# Altium schematic sheet main.SchDoc
size A4; SheetNumber: 1; SheetTotal: 3
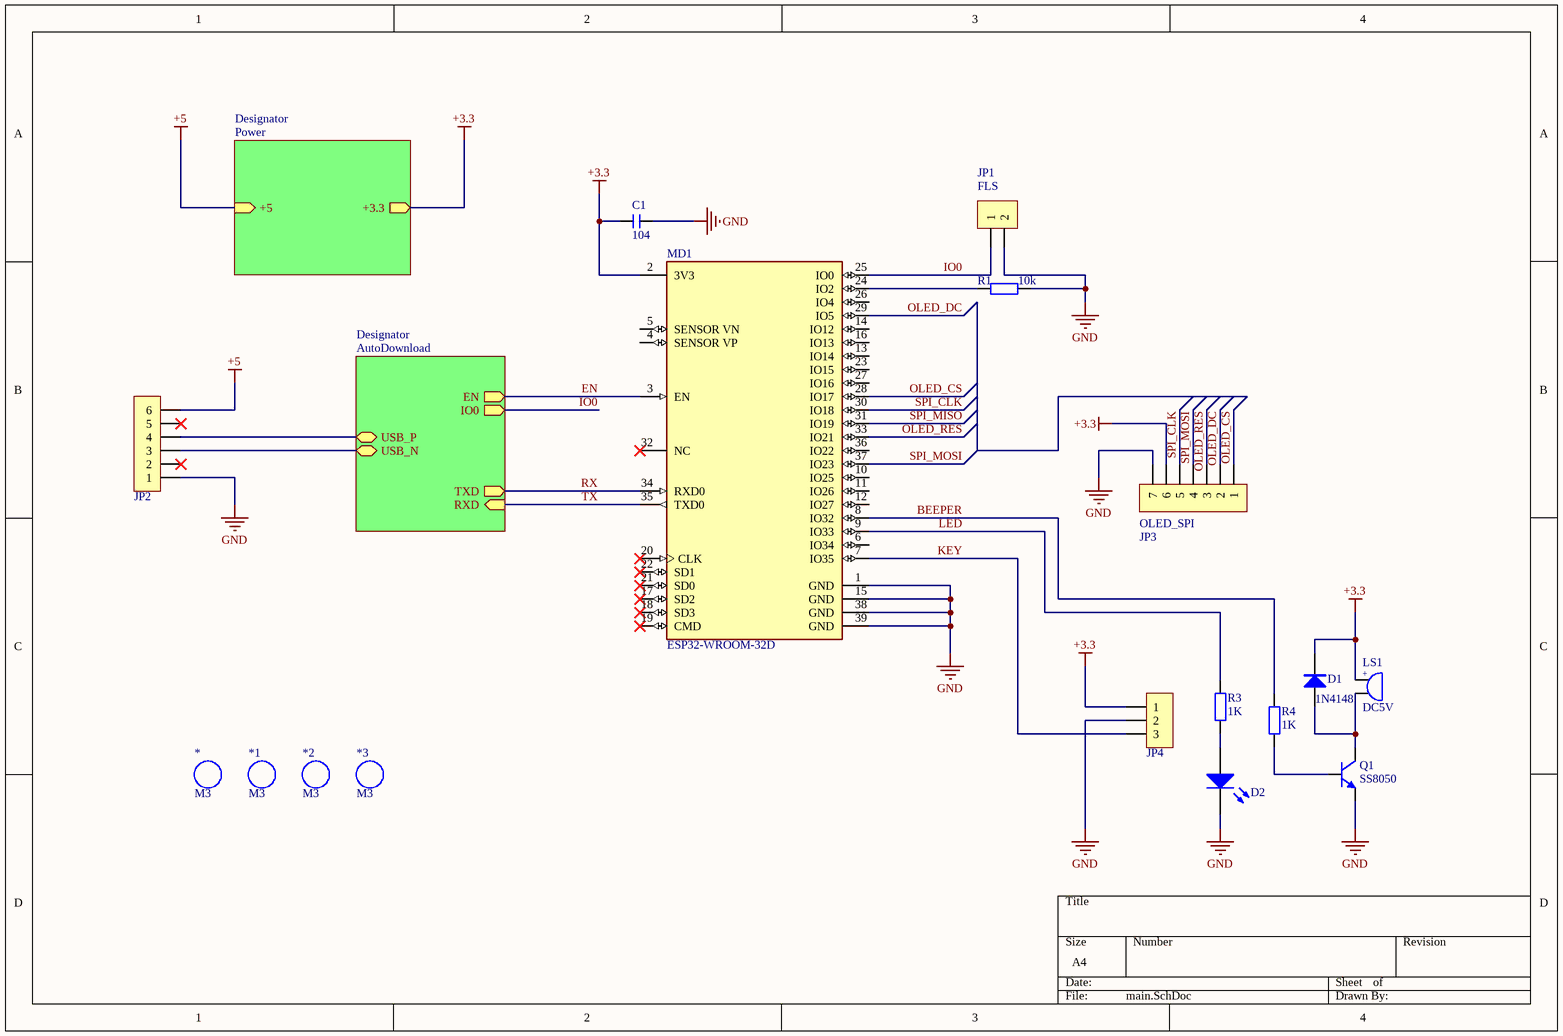
[diagram p0: main.SchDoc]

## Parts
*  M3  [M3 125X200]
*1  M3  [M3 125X200]
*2  M3  [M3 125X200]
*3  M3  [M3 125X200]
C1  104  [C 0603-L]
D1  1N4148  [MINI_MELF (LL34)]
D2  LED  [LED 0603R]  (value not drawn)
JP1  FLS  [HDR1.27-LI-2P]
JP2  HDR-1X6  [XH2.54-LI-6P]  (value not drawn)
JP3  OLED_SPI  [HDR2.54-M-LI-7P]
JP4  HDR-1X3  [XH2.54-LI-3P]  (value not drawn)
LS1  DC5V  [BEEP 5x9x5.5]
MD1  ESP32-WROOM-32D  [FP-ESP32-WROOM-32D-MFG]
Q1  SS8050  [SOT23-3N]
R1  10k  [R 0603_L]
R3  1K  [R 0603_L]
R4  1K  [R 0603_L]

## Sub-sheets
Designator = AutoDownload: TXD (out), USB_P (bidir), EN (out), RXD (in), IO0 (out), USB_N (bidir)
Designator = Power: +3.3 (out), +5 (in)

## Nets
+3.3: C1.1 D1.2(K) JP3.6 JP4.1 LS1.1 MD1.2(3V3) ; sheet Designator/+3.3
+5: JP2.6 ; sheet Designator/+5
GND: C1.2 D2.2(K) JP1.2 JP2.1 JP3.7 JP4.2 MD1.1(GND) MD1.15(GND) MD1.38(GND) MD1.39(GND) Q1.2(E) R1.2
BEEPER: MD1.8(IO32) R4.2
EN: MD1.3(EN) ; sheet Designator/EN
IO0: JP1.1 MD1.25(IO0) ; sheet Designator/IO0
KEY: JP4.3 MD1.7(IO35)
LED: MD1.9(IO33) R3.2
OLED_CS: JP3.1 MD1.28(IO17)
OLED_DC: JP3.2 MD1.29(IO5)
OLED_RES: JP3.3 MD1.33(IO21)
RX: MD1.34(RXD0) ; sheet Designator/TXD
SPI_CLK: JP3.5 MD1.30(IO18)
SPI_MISO: MD1.31(IO19)
SPI_MOSI: JP3.4 MD1.37(IO23)
TX: MD1.35(TXD0) ; sheet Designator/RXD
NetD1_1: D1.1(A) LS1.2 Q1.3(C)
NetD2_1: D2.1(A) R3.1
NetJP2_3: JP2.3 ; sheet Designator/USB_N
NetJP2_4: JP2.4 ; sheet Designator/USB_P
NetMD1_24: MD1.24(IO2) R1.1
NetQ1_1: Q1.1(B) R4.1

Not connected (* = marked no-connect by the designer): JP2 2* 5*; MD1 4(SENSOR_VP) 5(SENSOR_VN) 6(IO34) 10(IO25) 11(IO26) 12(IO27) 13(IO14) 14(IO12) 16(IO13) 17(SD2)* 18(SD3)* 19(CMD)* 20(CLK)* 21(SD0)* 22(SD1)* 23(IO15) 26(IO4) 27(IO16) 32(NC)* 36(IO22)

## Notes on the sheet
- (in symbol BEEP) +

## Library data of the parts
* *1-*3 = M3: 铜柱孔; 封装库来自淘宝卖家 ID：黄晶宝石: 其他店铺购入均为盗版，请立即申请退款，本店提供现金奖励; 免费技术支持，联系售后: 唯一出售店铺网址https://shop463601444.taobao.com; BOM名称: 铜柱孔
C1 = C: 贴片电容; BOM名称: 无极性贴片电容; 优秀评价可免费更新: 联系淘宝ID：黄晶宝石，获取更新版封装库; 本封装库来自淘宝卖家 ID：黄晶宝石: 其他店铺购入均为盗版，请立即申请退款; 联系卖家，免费查找封装: 唯一出售店铺网址https://shop463601444.taobao.com
D1 = 1N4148: 开关二极管; BOM名称: 高速开关二极管; 优秀评价可免费更新: 联系淘宝ID：黄晶宝石，获取更新版封装库; 封装库 来自淘宝卖家 ID：黄晶宝石: 其他店铺购入均为盗版，请立即申请退款; 卖家免费查找封装，联系售后: 唯一出售店铺网址https://shop463601444.taobao.com
D2 = LED: 发光二极管; 优秀评价可免费更新: 联系淘宝ID：黄晶宝石，获取更新版封装库; 封装库来自淘宝卖家 ID：黄晶宝石: 其他店铺购入均为假冒，请立即申请退款，本店奖励2~5元现金; 卖家免费查找封装，联系售后: 唯一出售店铺网址https://shop463601444.taobao.com
JP1 = Header 2: 2P接插件; 优秀评价可免费更新封装库: 联系淘宝ID：黄晶宝石，获取更新版封装库; 卖家免费技术支持，联系售后: 唯一出售店铺网址https://shop463601444.taobao.com; 封装库来自淘宝卖家 ID：黄晶宝石: 其他店铺购入均为盗版，请立即申请退款
JP2 = Header 6: 6P接插件; 封装库来自淘宝卖家  ID：黄晶宝石: 其他店铺购入均为盗版假冒封装库，请立即申请退款; 技术支持， 联系售后: 唯一出售店铺网址https://shop463601444.taobao.com; BOM名称: 6P接插件
JP3 = Header 7: 7P接插件; 封装库来自淘宝卖家  ID：黄晶宝石: 其他店铺购入均为盗版假冒封装库，请立即申请退款; 技术支持， 联系售后: 唯一出售店铺网址https://shop463601444.taobao.com; BOM名称: 7P接插件
JP4 = Header 3: 3P接插件; 封装库来自淘宝卖家  ID：黄晶宝石: 其他店铺购入均为盗版假冒封装库，请立即申请退款; 技术支持， 联系售后: 唯一出售店铺网址https://shop463601444.taobao.com; BOM名称: 3P接插件
LS1 = BEEP: 蜂鸣器; 封装库来自淘宝卖家 ID：黄晶宝石: 其他店铺购入均为盗版，请立即申请退款，本店提供现金奖励; 免费技术支持，联系售后: 唯一出售店铺网址https://shop463601444.taobao.com; BOM名称: 蜂鸣器
MD1 = CMP-194065-000003-1: WIFI MODULE 32MBITS SPI FLASH; Manufacturer: Espressif Systems; Max Supply Voltage: 3.6V; Nominal Supply Current: 500mA; Max Frequency: 2484MHz; Number Of Adc Channels: 16; Number Of Gpio: 32; Interface: I2C,SPI,UART,Ethernet,I2S,Other; Data Rate: 150Mbits/s; Min Supply Voltage: 3V; Bandwidth: 72MHz; Sensitivity: -98dBm; Octopart: https://octopart.com/esp32-wroom-32d-espressif+systems-91040050; Package: ESP32-WROOM-32D; ComponentLink2URL: https://www.espressif.com/sites/default/files/documentation/esp32-wroom-32d_esp32-wroom-32u_datasheet_en.pdf; Lead Free: Yes; Category: UNK; Mouser Description: Wi-Fi/BT BLE Module ESP32-D0WD, SPI Flash, UART, P; Device Class L1: Integrated Circuits (ICs); RoHS: TRUE; Temperature Range Low: -40°C; ComponentLink2Description: Datasheet; Digikey Description: WIFI MODULE 32MBITS SPI FLASH; Height: 3.2mm; Temperature: -40°C to +85°C; Manufacturer Part Number: ESP32-WROOM-32D; Device Class L3: Transceivers; Device Class L2: RF Semiconductors and Devices; Temperature Range High: +85°C; Automotive: No
Q1 = 8050-SMD: 高频放大-NPN型; 属性: 40V 1.5A 1W 100MHZ; 卖家免费技术支持，联系售后: 唯一出售店铺网址https://shop463601444.taobao.com; 封装库来自淘宝卖家 ID：黄晶宝石: 其他店铺购入均为假冒，请立即申请退款，本店奖励2~5元现金; BOM名称: 高频放大-NPN型; 卖家免费查找封装，联系售后: 唯一出售店铺网址https://shop463601444.taobao.com
R1 R3 R4 = R: 贴片电阻; 优秀评价可免费更新: 联系淘宝ID：黄晶宝石，获取更新版封装库; 本封装库来自淘宝卖家 ID：黄晶宝石: 其他店铺购入均为盗版，请立即申请退款; 联系卖家，免费查找封装: 唯一出售店铺网址https://shop463601444.taobao.com; BOM名称: 贴片电阻